# EasyEDA Pro project ProPrj_电子工程训练1_2024-12-26.epro

# Schematic Schematic1
Create Date: 2024-05-21; Page Name: P1; Project Name: 电子工程训练1; Schematic Name: Schematic1; Update Date: 2024-05-22; Company: 嘉立创EDA; Page Size: A4; Version: V1.0
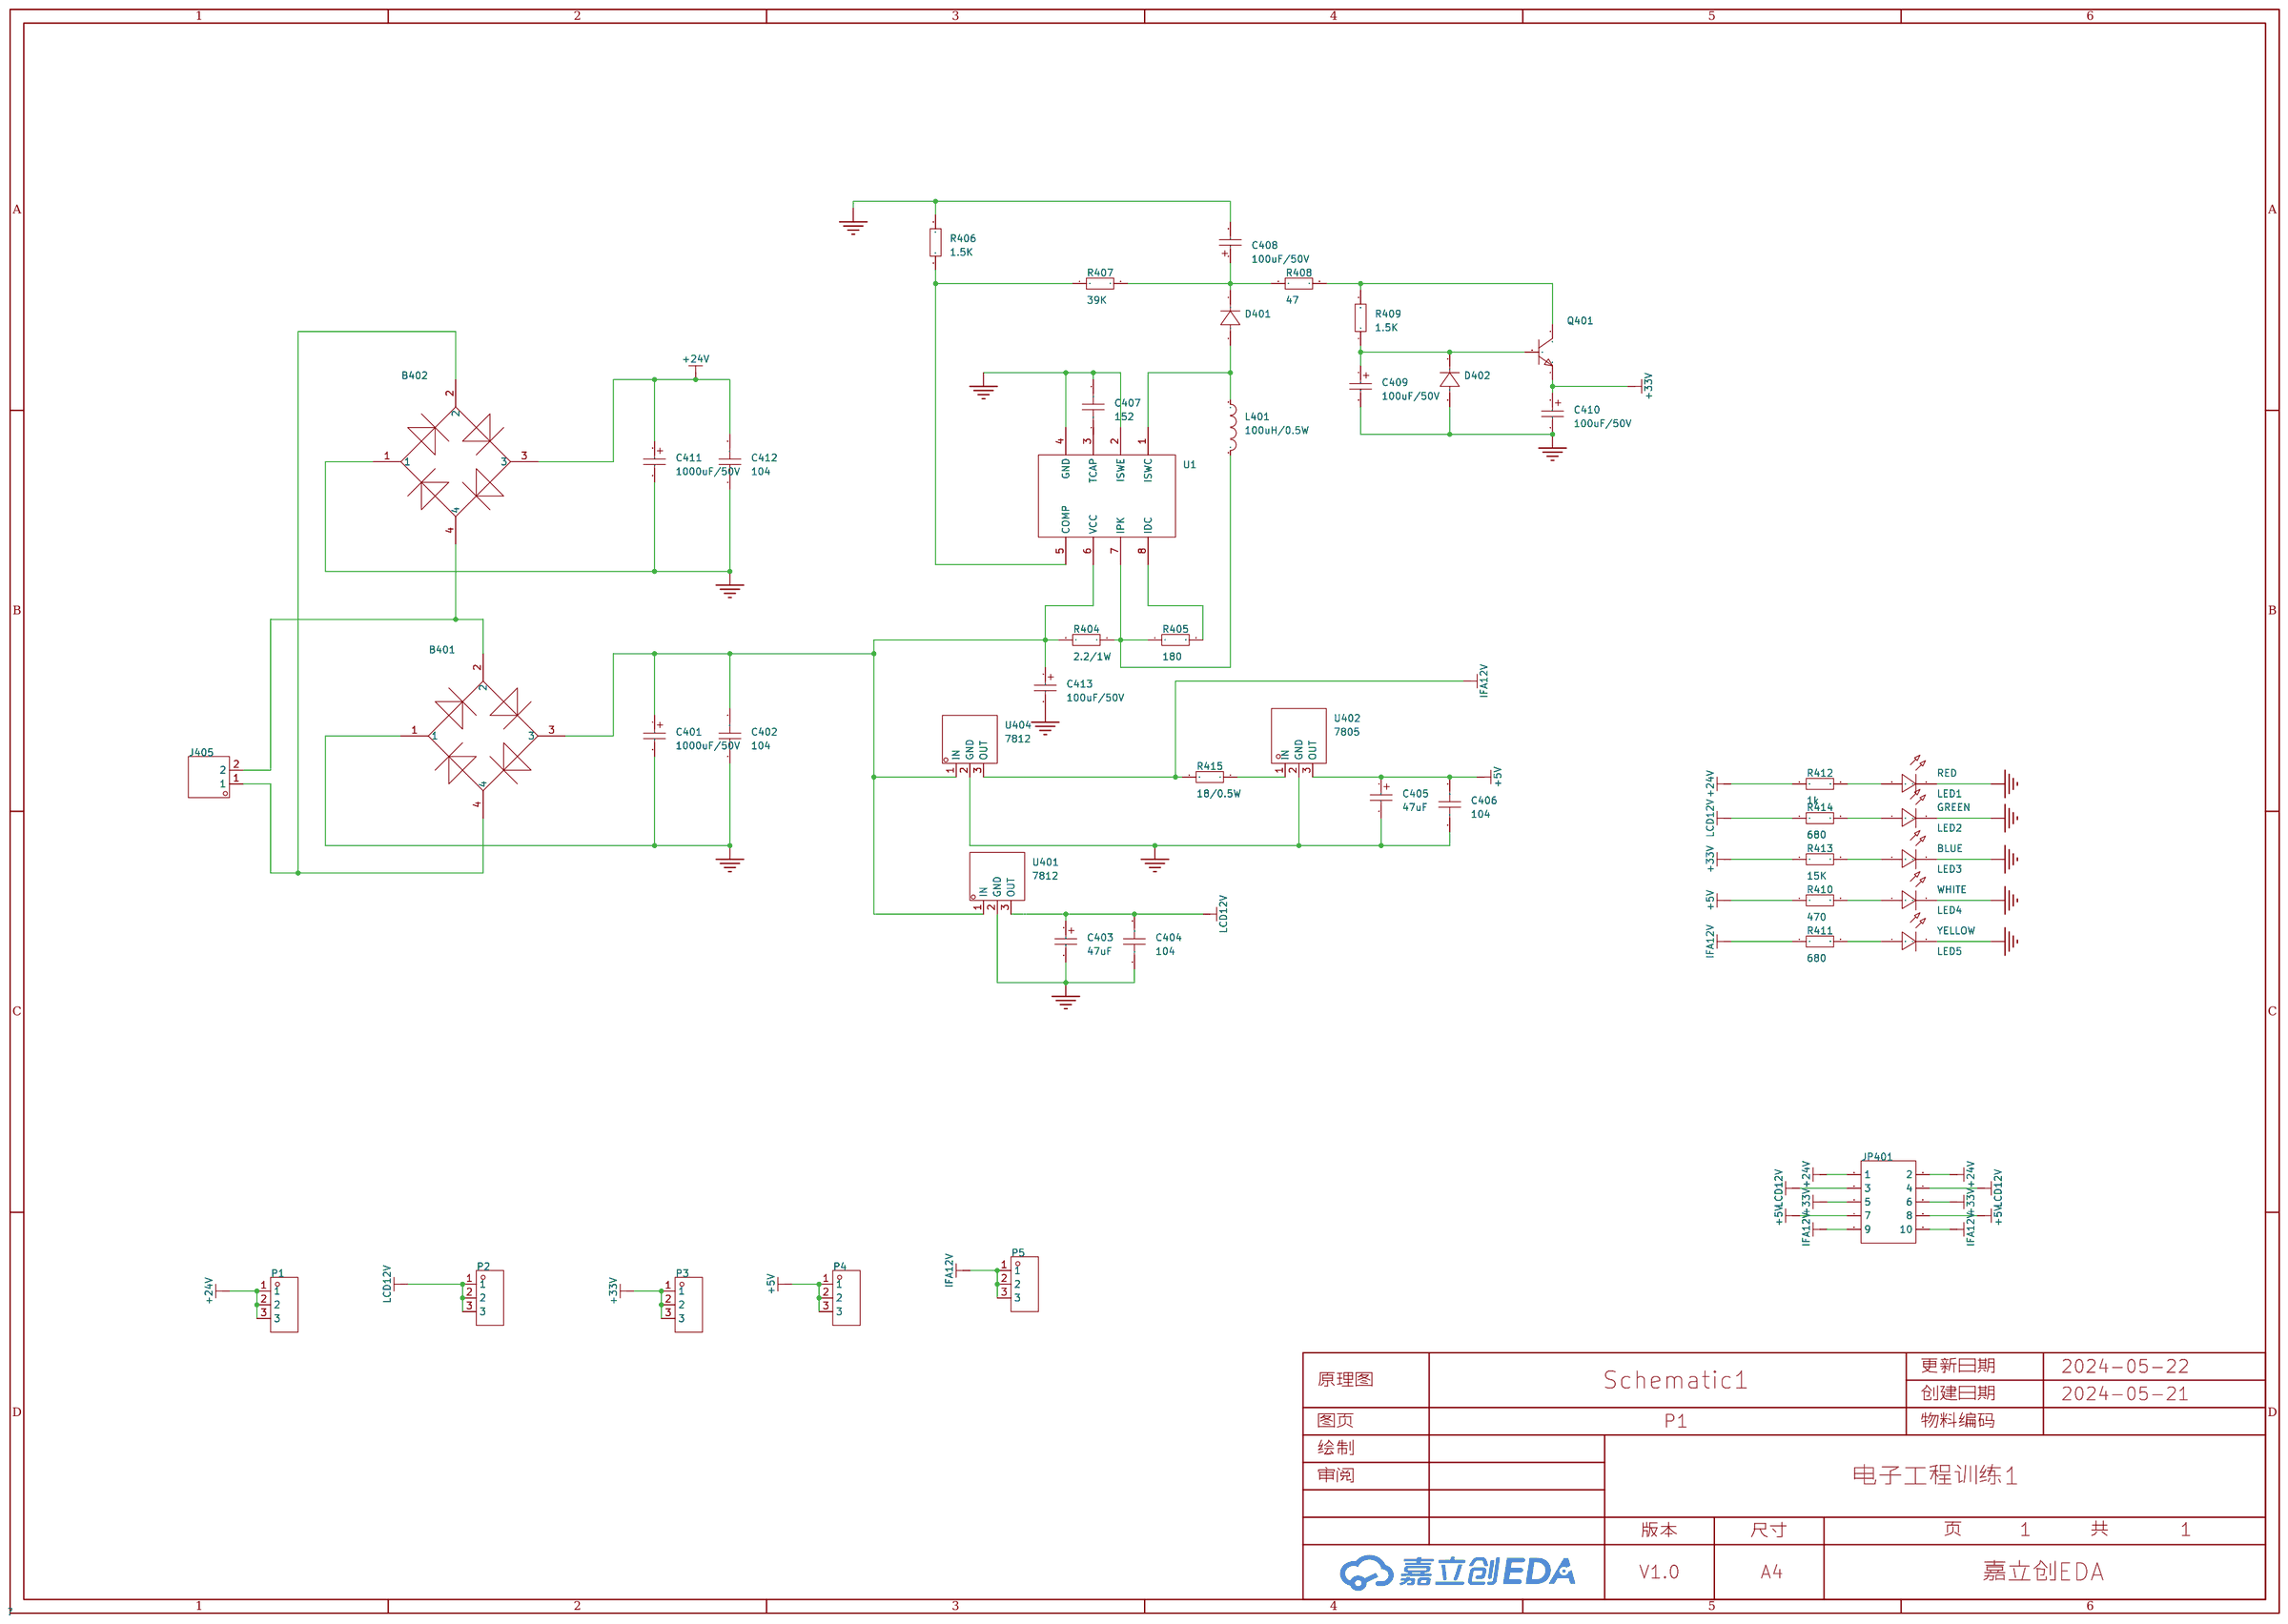
[diagram p0: schematic sheet]

## Parts
B401  -  [B401/B402]
B402  -  [B401/B402]
C401  1000uF/50V  [C401/C411]
C402  104  [RAD-0.2]
C403  47uF  [电解电容]
C404  104  [RAD-0.2]
C405  47uF  [电解电容]
C406  104  [RAD-0.2]
C407  152  [RAD-0.2]
C408  100uF/50V  [电解电容]
C409  100uF/50V  [电解电容]
C410  100uF/50V  [电解电容]
C411  1000uF/50V  [C401/C411]
C412  104  [RAD-0.2]
C413  100uF/50V  [电解电容]
D401  -  [D401/D402]
D402  -  [D401/D402]
J405  -  [J405]
JP401  -  [JP401]
L401  100uH/0.5W  [L401]
LED1  RED  [LED]
LED2  GREEN  [LED]
LED3  BLUE  [LED]
LED4  WHITE  [LED]
LED5  YELLOW  [LED]
P1  -  [HDR-TH_3P-P2.54-V-F]
P2  -  [HDR-TH_3P-P2.54-V-F]
P3  -  [HDR-TH_3P-P2.54-V-F]
P4  -  [HDR-TH_3P-P2.54-V-F]
P5  -  [HDR-TH_3P-P2.54-V-F]
Q401  -  [Q401]
R404  2.2/1W  [Res_1/2W]
R405  180  [Res_1/4W]
R406  1.5K  [Res_1/4W]
R407  39K  [Res_1/4W]
R408  47  [Res_1/4W]
R409  1.5K  [Res_1/4W]
R410  470  [Res_1/4W]
R411  680  [Res_1/4W]
R412  1k  [Res_1/4W]
R413  15K  [Res_1/4W]
R414  680  [Res_1/4W]
R415  18/0.5W  [Res_1/2W]
U1  -  [DIP-8_L10.0-W6.5-P2.54-LS7.6-BL-A]
U401  7812  [U401/U402/U404]
U402  7805  [U401/U402/U404]
U404  7812  [U401/U402/U404]

## Library data of the parts
B401 B402 = 整流桥
C401 C403 C405 C408-C411 C413 = C_Ele_SMD_3x5.4mm: Supplier Footprint: SMD,3x5.4mm
C402 C404 C406 C407 C412 = CAP_0603: Supplier Footprint: 0603
D401 D402 = D_1N4007A: Supplier Footprint: DO-41
J405 = HDR-M_2.54_1x2P: Supplier Part: C124375; Supplier Footprint: 插件
JP401 = HDR-F_2.54_2x5: Supplier Part: C92270; Supplier Footprint: 插件
L401 = L_0603: Supplier Footprint: L0603
LED1-LED5 = LED_TH-R_3mm: Supplier Footprint: 插件
P1-P5 = HDR-F_2.54_1x3P: Supplier Part: C541850; Supplier Footprint: 插件
Q401 = S8050_SOT_NPN: Supplier Footprint: SOT-23
R404-R415 = Res_AXIAL-1/4W: Supplier Footprint: 轴向引线
U1 = MC34063
U401 U404 = 7812: 输出类型:固定;最大输入电压:35V;输出电压:12V;最大输出电流:1.5A;电源纹波抑制比(PSRR):55dB@(120Hz);输出极性:正极;; LCSC Part Name: 输入35V 输出12V 1.5A; Supplier Part: C358369; Manufacturer: BLUE ROCKET(蓝箭); Supplier Footprint: TO-220; JLCPCB Part Class: 扩展库; Datasheet: https://atta.szlcsc.com/upload/public/pdf/source/20190129/C358369_76FC1BF920F4FC034B3298D16553EF92.pdf; Supplier: LCSC; Output Type: 固定; Maximum Input Voltage: 35V; Output Voltage: 12V; MAX Output Current: 1.5A; Power Supply Rejection Ratio (PSRR): 55dB@(120Hz); Dropout Voltage: 2V@(1A); Output Polarity: 正极; Number of Outputs: 1
U402 = 7805: 输出类型:固定;最大输入电压:35V;输出电压:5V;最大输出电流:1.5A;电源纹波抑制比(PSRR):62dB@(120Hz);输出极性:正极;; LCSC Part Name: 输入35V 输出5V 1.5A; Supplier Part: C4944936; Manufacturer: SY(顺烨）; Supplier Footprint: TO-220AB; JLCPCB Part Class: 扩展库; Datasheet: https://atta.szlcsc.com/upload/public/pdf/source/20220719/323A3F14557C229271C454C7C0F759A5.pdf; Supplier: LCSC; Output Type: 固定; Maximum Input Voltage: 35V; Output Voltage: 5V; MAX Output Current: 1.5A; Power Supply Rejection Ratio (PSRR): 62dB@(120Hz); Output Polarity: 正极

## Nets
+5V: C405.1 C406.2 JP401.7 JP401.8 P4.1 P4.2 P4.3 R410.1 U402.3(OUT)
+24V: B402.3 C411.1 C412.2 JP401.1 JP401.2 P1.1 P1.2 P1.3 R412.1
+33V: C410.1 JP401.5 JP401.6 P3.1 P3.2 P3.3 Q401.1 R413.1
GND: B401.1 B402.1 C401.2 C402.1 C403.2 C404.1 C405.2 C406.1 C407.2 C408.2 C409.2 C410.2 C411.2 C412.1 C413.2 D402.2(A) LED1.2(A) LED2.2(A) LED3.2(A) LED4.2(A) LED5.2(A) R406.2 U1.2(ISWE) U1.4(GND) U401.2(GND) U402.2(GND) U404.2(GND)
IFA12V: JP401.9 JP401.10 P5.1 P5.2 P5.3 R411.1 R415.2 U404.3(OUT)
LCD12V: C403.1 C404.2 JP401.3 JP401.4 P2.1 P2.2 P2.3 R414.1 U401.3(OUT)
$1N466: B401.2 B402.4 J405.2
$1N564: B401.4 B402.2 J405.1
$1N710: C407.1 U1.3(TCAP)
$1N846: R406.1 R407.1 U1.5(COMP)
$1N1138: R405.2 U1.8(IDC)
$1N1148: L401.2 R404.1 R405.1 U1.7(IPK)
$1N1193: D401.2(A) L401.1 U1.1(ISWC)
$1N1296: C408.1 D401.1(K) R407.2 R408.1
$1N1364: C409.1 D402.1(K) Q401.3 R409.1
$1N1422: Q401.2 R408.2 R409.2
$1N1797: R415.1 U402.1(IN)
$1N1994: B401.3 C401.1 C402.2 C413.1 R404.2 U1.6(VCC) U401.1(IN) U404.1(IN)
$1N3575: LED1.1(C) R412.2
$1N3788: LED2.1(C) R414.2
$1N3791: LED3.1(C) R413.2
$1N3794: LED4.1(C) R410.2
$1N3797: LED5.1(C) R411.2

# Board PCB1
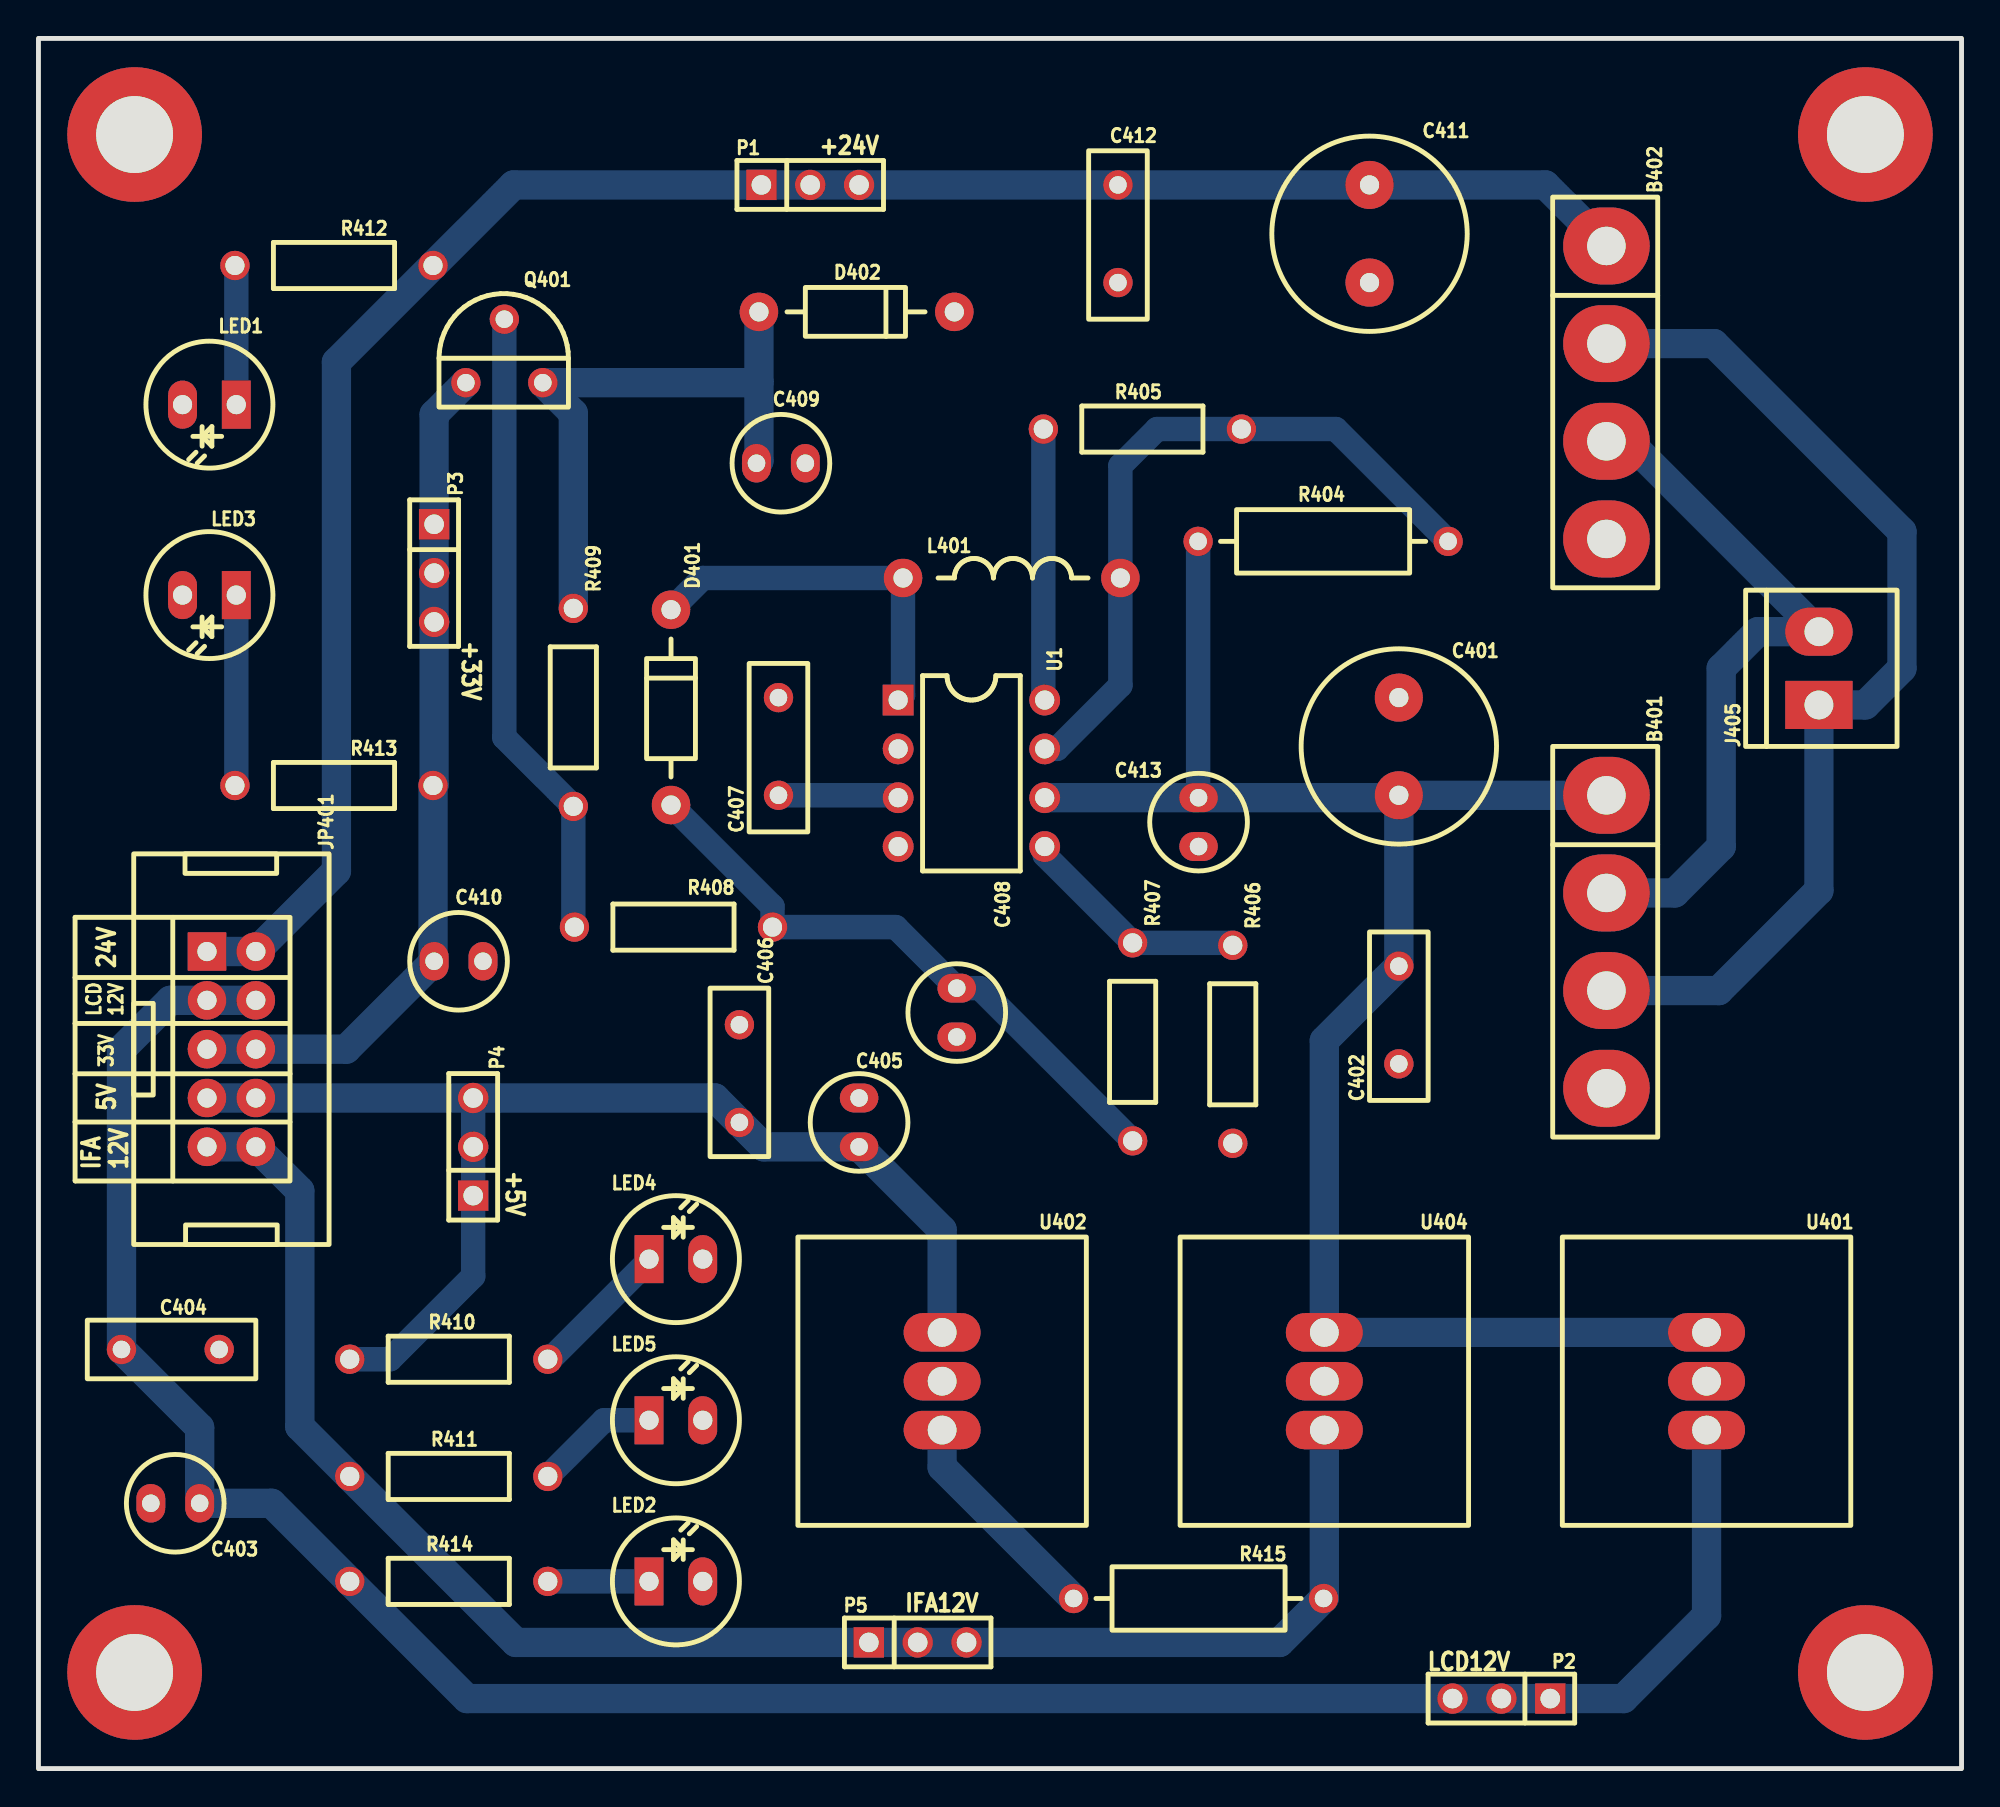
[diagram p1: board, top side]
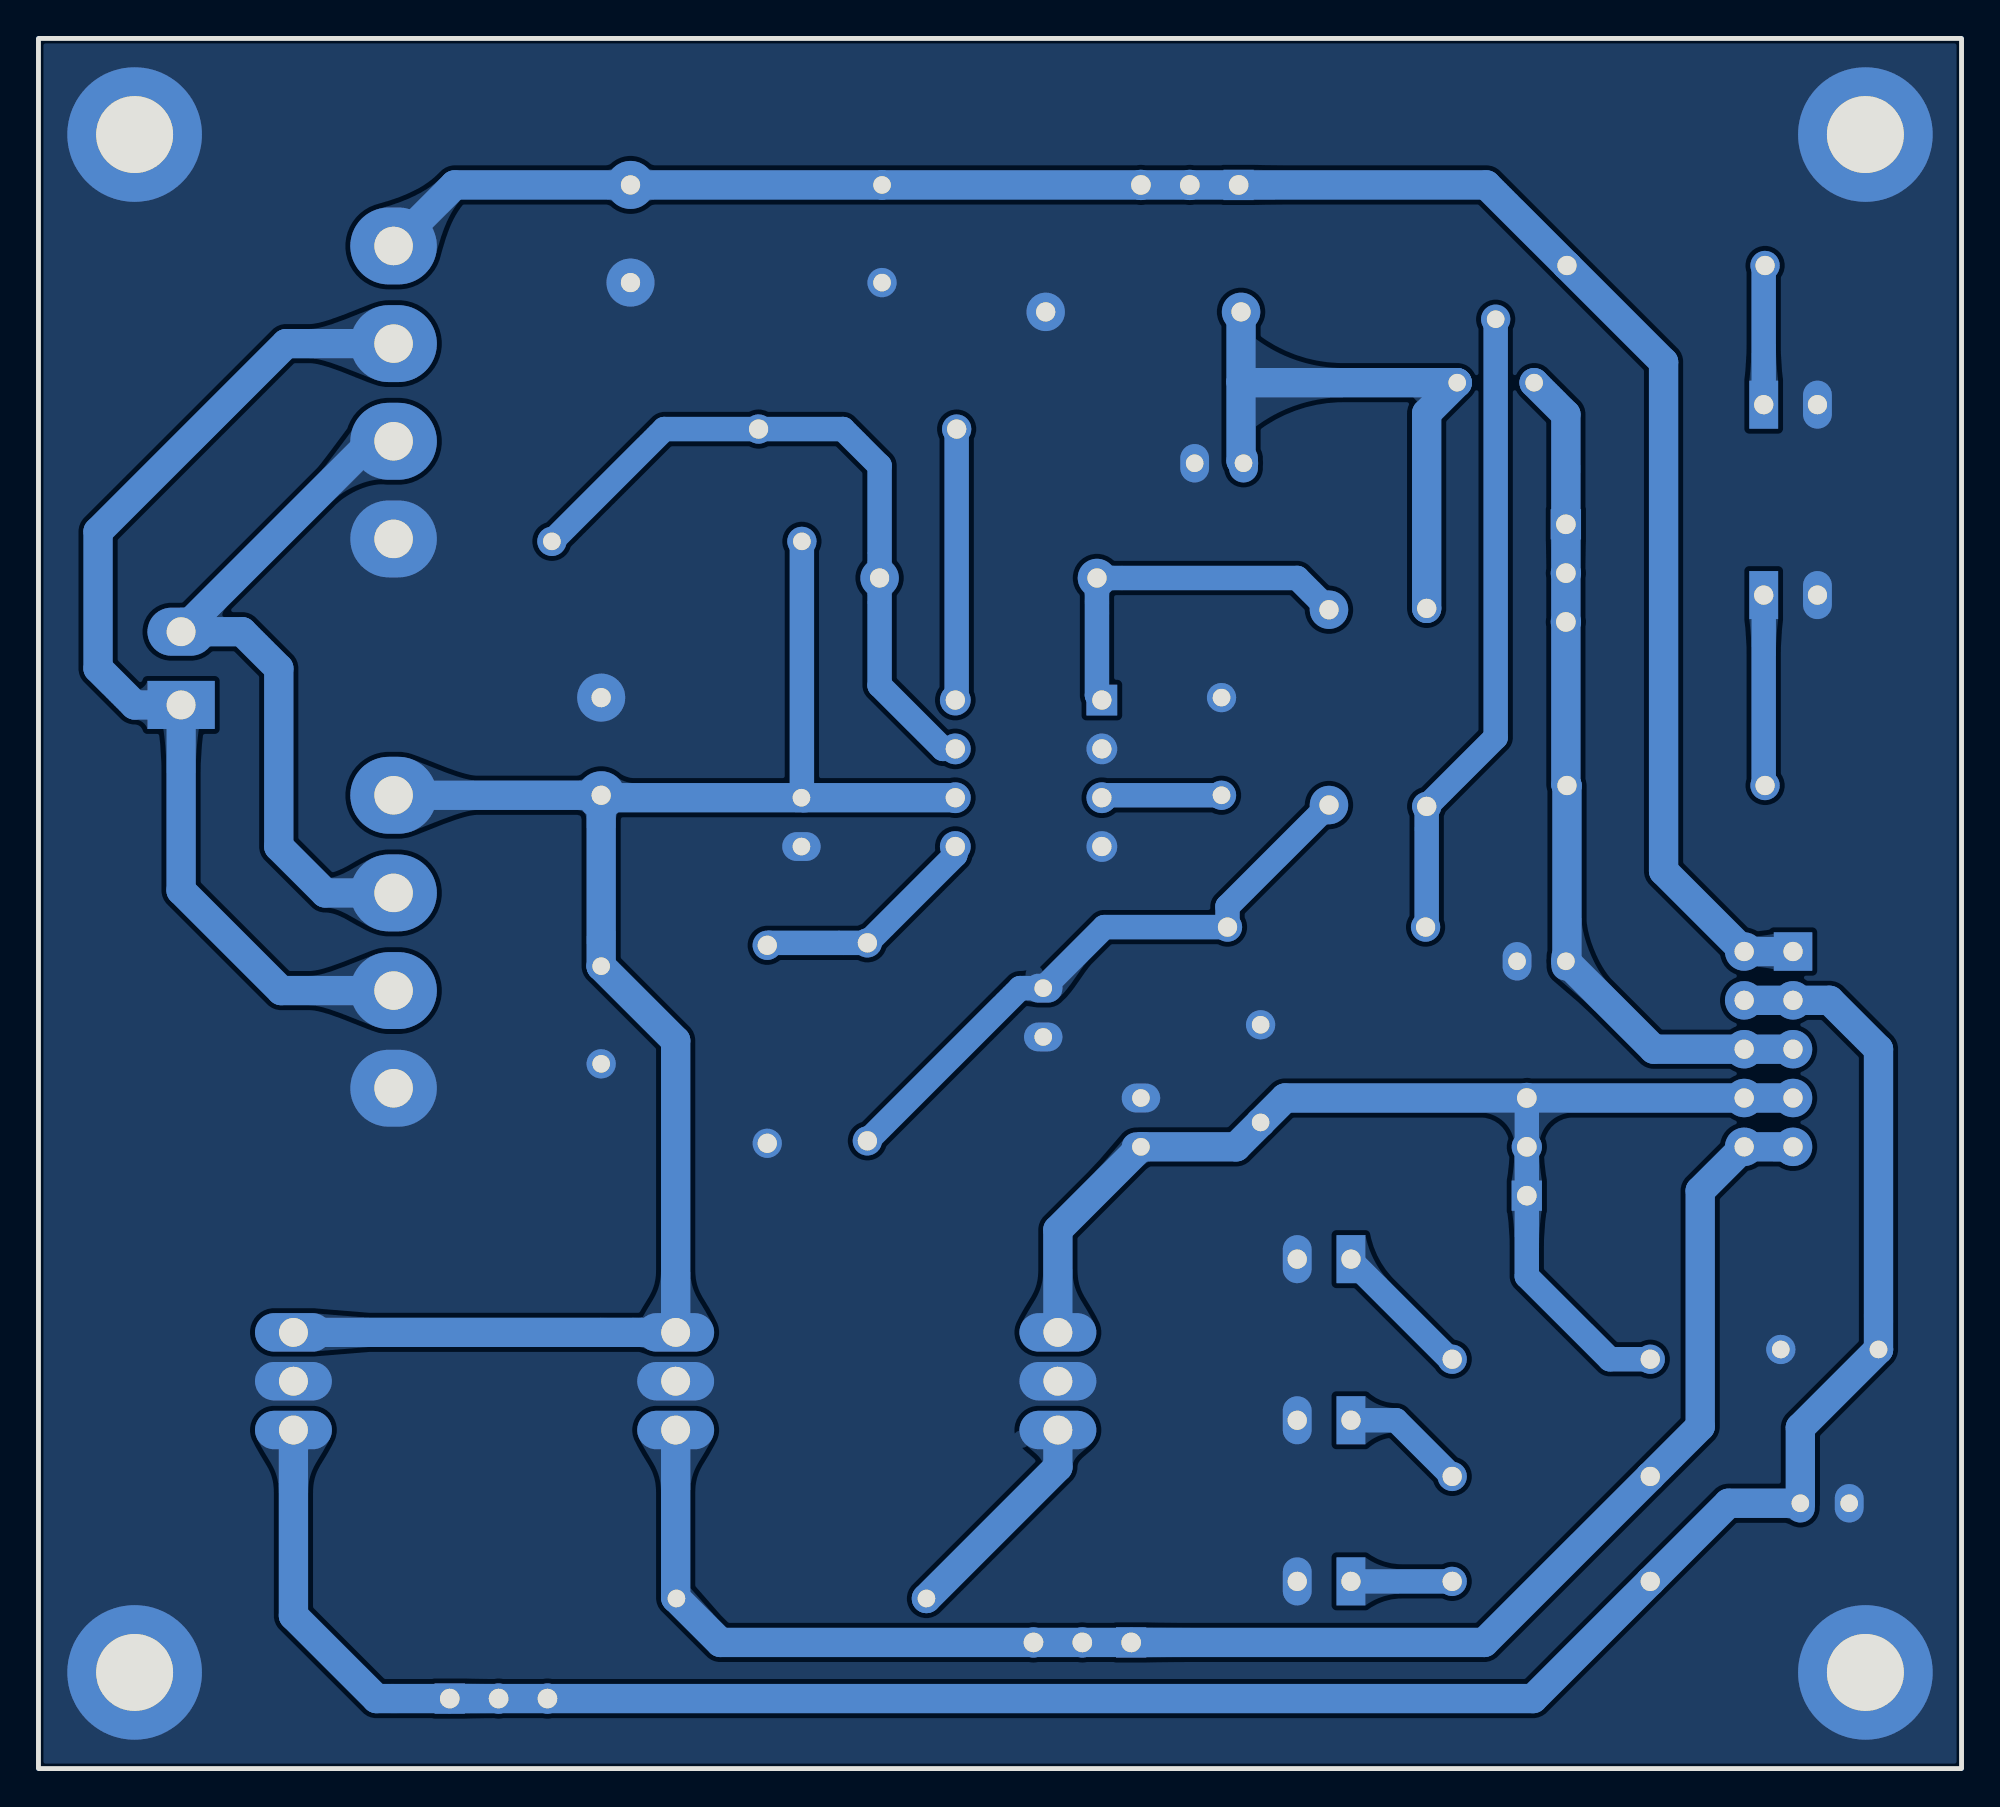
[diagram p2: board, bottom side, seen from below]

Outline 100 x 90 mm; copper layers: Top Layer, Bottom Layer. Coordinates in mm from the lower left corner of the outline.
Outline path: rectangle 0,90 100,0
Stack: Top Layer 0.035mm / Dielectric1 1.51mm FR4 er 4.5 / Bottom Layer 0.035mm

## Design rules (mm)
template: 自定义配置
spacing copperThickness1oz (default): track to track 0.102, other pairs 0.152 to 0.3
spacing copperThickness2oz: track to track 0.203, other pairs 0.152 to 0.3
track width copperThickness1oz (default): min 0.762, default 1.016, max 2.54
track width copperThickness2oz: min 0.203, default 0.254, max 2.54
differential pair differentialPair (default): width min 0.127, default 0.254, max 2.54; gap min 0.152, default 0.152
via viaSize (default): diameter min 0.5, default 0.61, max 10; hole min 0.3, default 0.305, max 6.299
net GND uses copperRegion1

## Placement (name value [footprint] x y rotation side)
B401  -  [B401/B402]  81.53 50.63 270 top
B402  -  [B401/B402]  81.53 79.2 270 top
C401  1000uF/50V  [C401/C411]  70.74 50.63 90 top
C402  104  [RAD-0.2]  70.74 39.2 90 top
C403  47uF  [电解电容]  8.38 13.8 180 top
C404  104  [RAD-0.2]  6.86 21.8 180 top
C405  47uF  [电解电容]  42.67 32.34 90 top
C406  104  [RAD-0.2]  36.45 36.15 270 top
C407  152  [RAD-0.2]  38.48 53.17 90 top
C408  100uF/50V  [电解电容]  47.75 40.6 270 top
C409  100uF/50V  [电解电容]  37.34 67.9 0 top
C410  100uF/50V  [电解电容]  20.57 41.99 0 top
C411  1000uF/50V  [C401/C411]  69.22 82.38 270 top
C412  104  [RAD-0.2]  56.13 79.84 90 top
C413  100uF/50V  [电解电容]  60.32 50.5 270 top
D401  -  [D401/D402]  32.89 60.28 270 top
D402  -  [D401/D402]  47.62 75.78 180 top
J405  -  [J405]  92.58 55.33 90 top
JP401  -  [JP401]  8.76 42.5 270 top
L401  100uH/0.5W  [L401]  44.96 61.93 0 top
LED1  RED  [LED]  10.29 70.95 180 top
LED2  GREEN  [LED]  31.75 9.74 0 top
LED3  BLUE  [LED]  10.29 61.04 180 top
LED4  WHITE  [LED]  31.75 26.5 0 top
LED5  YELLOW  [LED]  31.75 18.12 0 top
NOREF  -  [Pad_e47]  5 85 0 top
NOREF#2  -  [Pad_e50]  95 85 0 top
NOREF#3  -  [Pad_e51]  95 5 0 top
NOREF#4  -  [Pad_e49]  5 5 0 top
P1  -  [HDR-TH_3P-P2.54-V-F]  40.13 82.38 0 top
P2  -  [HDR-TH_3P-P2.54-V-F]  76.07 3.64 180 top
P3  -  [HDR-TH_3P-P2.54-V-F]  20.57 62.19 270 top
P4  -  [HDR-TH_3P-P2.54-V-F]  22.61 32.34 90 top
P5  -  [HDR-TH_3P-P2.54-V-F]  45.72 6.56 0 top
Q401  -  [Q401]  22.22 72.09 0 top
R404  2.2/1W  [Res_1/2W]  66.8 63.84 180 top
R405  180  [Res_1/4W]  57.4 69.68 180 top
R406  1.5K  [Res_1/4W]  62.1 37.68 270 top
R407  39K  [Res_1/4W]  56.9 37.8 270 top
R408  47  [Res_1/4W]  33.02 43.77 180 top
R409  1.5K  [Res_1/4W]  27.81 55.2 270 top
R410  470  [Res_1/4W]  21.34 21.29 0 top
R411  680  [Res_1/4W]  21.34 15.2 0 top
R412  1k  [Res_1/4W]  15.37 78.19 180 top
R413  15K  [Res_1/4W]  15.37 51.14 180 top
R414  680  [Res_1/4W]  21.34 9.74 0 top
R415  18/0.5W  [Res_1/2W]  60.32 8.85 0 top
U1  -  [DIP-8_L10.0-W6.5-P2.54-LS7.6-BL-A]  48.51 51.77 270 top
U401  7812  [U401/U402/U404]  86.74 20.15 270 top
U402  7805  [U401/U402/U404]  46.99 20.15 90 top
U404  7812  [U401/U402/U404]  66.87 20.15 270 top

## Footprints (pads in the part's own frame, mm; a bottom-side part is the same pattern mirrored in y, then rotated)
B401/B402
  oval 4x4.5 hole 2: 1(15.24,0) 2(5.08,0) 3(0,0) 4(10.16,0)
C401/C411
  round 2.5 hole 1: 1(0,0) 2(5.08,0)
D401/D402
  round 2 hole 1: 1(10.16,0) 2(0,0)
DIP-8_L10.0-W6.5-P2.54-LS7.6-BL-A
  rect 1.6x1.6 hole 1: 1(-3.81,-3.81)
  round 1.6 hole 1: 2(-1.27,-3.81) 3(1.27,-3.81) 4(3.81,-3.81) 5(3.81,3.81) 6(1.27,3.81) 7(-1.27,3.81) 8(-3.81,3.81)
HDR-TH_3P-P2.54-V-F
  rect 1.575x1.575 hole 1.02: 1(-2.54,0)
  round 1.575 hole 1.02: 2(0,0) 3(2.54,0)
J405
  rect 2.5x3.5 hole 1.5: 1(0,0)
  oval 2.5x3.5 hole 1.5: 2(3.81,0)
JP401
  rect 2x2 hole 1: 1(0,0)
  round 2 hole 1: 2(0,2.54) 3(2.54,0) 4(2.54,2.54) 5(5.081,0) 6(5.081,2.54) 7(7.62,0) 8(7.62,2.54) 9(10.16,0) 10(10.16,2.54)
L401
  round 2 hole 1: 1(0,0) 2(11.303,0)
LED
  rect 1.5x2.5 hole 1: 1(0,0)
  oval 1.5x2.5 hole 1: 2(2.794,0)
Pad_e47
  round 7 hole 4: 1(0,0)
Pad_e49
  round 7 hole 4: 2(0,0)
Pad_e50
  round 7 hole 4: 4(0,0)
Pad_e51
  round 7 hole 4: 3(0,0)
Q401
  round 1.524 hole 0.914: 1(0,0) 2(2,3.302) 3(4,0)
RAD-0.2
  round 1.524 hole 0.914: 1(-2.54,0) 2(2.54,0)
Res_1/2W
  round 1.524 hole 0.914: 1(-6.5,0) 2(6.5,0)
Res_1/4W
  round 1.524 hole 1: 1(-5.15,0) 2(5.15,0)
U401/U402/U404
  oval 2x4 hole 1.5: 1(-2.54,0) 2(0,0) 3(2.54,0)
电解电容
  oval 1.5x2 hole 0.914: 1(0,0) 2(2.54,0)

## Nets
As in the schematic, except:
GND: B401.1 B402.1 C401.2 C402.1 C403.2 C404.1 C405.2 C406.1 C407.2 C408.2 C409.2 C410.2 C411.2 C412.1 C413.2 D402.2 LED1.2 LED2.2 LED3.2 LED4.2 LED5.2 NOREF.1 NOREF#2.4 NOREF#3.3 NOREF#4.2 R406.2 U1.2 U1.4 U401.2 U402.2 U404.2

## Via types
v1: diameter 0.61, hole 0.305, Top Layer to Bottom Layer, 2 vias

## Routing (per net, layer and track width the routed paths; a pad name or vN(x,y) marks a point on that pad's centre or on a via; arc(x,y) is an arc through that point)
+5V: length 63.9
  Bottom Layer w1.27: R410.1 18.29,21.29 22.61,25.61 P4.1 P4.2 P4.3
  Bottom Layer w1.524: JP401.7 JP401.8 P4.3 35.18,34.88 C406.2 37.72,32.34 C405.1 46.99,28.02 U402.3
+24V: length 106.3
  Bottom Layer w1.27: 8.64,42.63 JP401.1
  Bottom Layer w1.524: JP401.1 JP401.2 15.49,46.69 15.49,73.17 24.71,82.38 P1.1 P1.2 P1.3 C412.2 C411.1 78.36,82.38 B402.3
+33V: length 44.5
  Bottom Layer w1.524: Q401.1 20.57,70.44 P3.1 P3.2 20.57,51.19 20.52,51.14 20.52,42.05 C410.1 16,37.42 JP401.6 JP401.5
IFA12V: length 85.7
  Bottom Layer w1.524: U404.3 66.87,8.89 R415.2 64.54,6.56 P5.3 P5.2 P5.1 24.82,6.56 R411.1 13.59,17.79 13.59,30.06 JP401.10 JP401.9
LCD12V: length 127.4
  Bottom Layer w1.524: U401.3 86.74,7.96 82.42,3.64 P2.1 P2.2 22.28,3.64 R414.1 12.12,13.8 C403.1 8.38,17.74 C404.2 4.32,37.42 6.86,39.96 JP401.3 JP401.4
$1N466: length 37.3
  Bottom Layer w1.524: B402.4 82.68,69.05 J405.2 89.41,59.14 87.5,57.23 87.5,47.96 85.09,45.55 B401.2
$1N564: length 54.5
  Bottom Layer w1.524: B402.2 87.12,74.12 96.9,64.35 96.9,57.23 95,55.33 J405.1 92.58,45.68 87.38,40.47 B401.4
$1N710: length 6.3
  Bottom Layer w1.27: C407.1 44.58,50.63 U1.3
$1N846: length 12.2
  Bottom Layer w1.27: R406.1 61.98,42.95 R407.1 52.32,47.53 U1.5
$1N1138: length 14.1
  Bottom Layer w1.27: R405.2 52.25,55.65 U1.8
$1N1148: length 37
  Bottom Layer w1.27: 52.32,53.04 52.96,53.04 56.26,56.34 L401.2 56.26,67.78 58.17,69.68 R405.1 67.46,69.68 R404.1
$1N1193: length 19.2
  Bottom Layer w1.27: U1.1 44.96,55.84 L401.1 34.54,61.93 D401.2
$1N1296: length 31.9
  Bottom Layer w1.27: R407.2 48.95,40.6 C408.1 44.58,43.77 R408.1 38.17,44.84 v1(32.89,50.12)
$1N1364: length 31.6
  Bottom Layer w1.524: v1(37.47,75.78) 37.47,72.15 ; 37.47,72.15 37.41,72.09 Q401.3 27.81,70.5 R409.1 ; 37.47,72.15 37.47,68.03 C409.1
$1N1422: length 33.1
  Bottom Layer w1.27: R408.2 27.81,43.83 R409.2 24.22,53.64 Q401.2
$1N1797: length 11.6
  Bottom Layer w1.524: R415.1 46.99,15.68 U402.1
$1N1994: length 92.1
  Bottom Layer w1.27: R404.2 60.3,50.53 C413.1
  Bottom Layer w1.524: C401.1 70.61,50.5 C413.1 ; C401.1 C402.2 66.87,37.87 U404.1 U401.1 ; C401.1 B401.3 ; 60.3,50.63 60.18,50.5 U1.6
$1N3575: length 7.3
  Bottom Layer w1.27: R412.2 10.29,78.12 LED1.1
$1N3788: length 5.3
  Bottom Layer w1.27: R414.2 LED2.1
$1N3791: length 9.9
  Bottom Layer w1.27: LED3.1 10.29,51.21 R413.2
$1N3794: length 7.5
  Bottom Layer w1.27: R410.2 26.61,21.29 31.75,26.43 LED4.1
$1N3797: length 6.5
  Bottom Layer w1.27: R411.2 29.41,18.12 LED5.1

## Copper pours and planes (outline as drawn; the poured copper is in the pictures)
GND on Bottom Layer: 0,90 100,90 100,0 0,0

Small or netless copper shapes (teardrops, artwork), in the pictures only: 69 on Bottom Layer

## Text on the board
Top Silkscreen Layer: 33V | LCD / 12V | 24V | 5V | IFA / 12V | +24V | IFA12V | LCD12V | +33V | +5V
